# EAGLE design Rov3 - zsilanie cyfrowe (EAGLE 9.4.2)
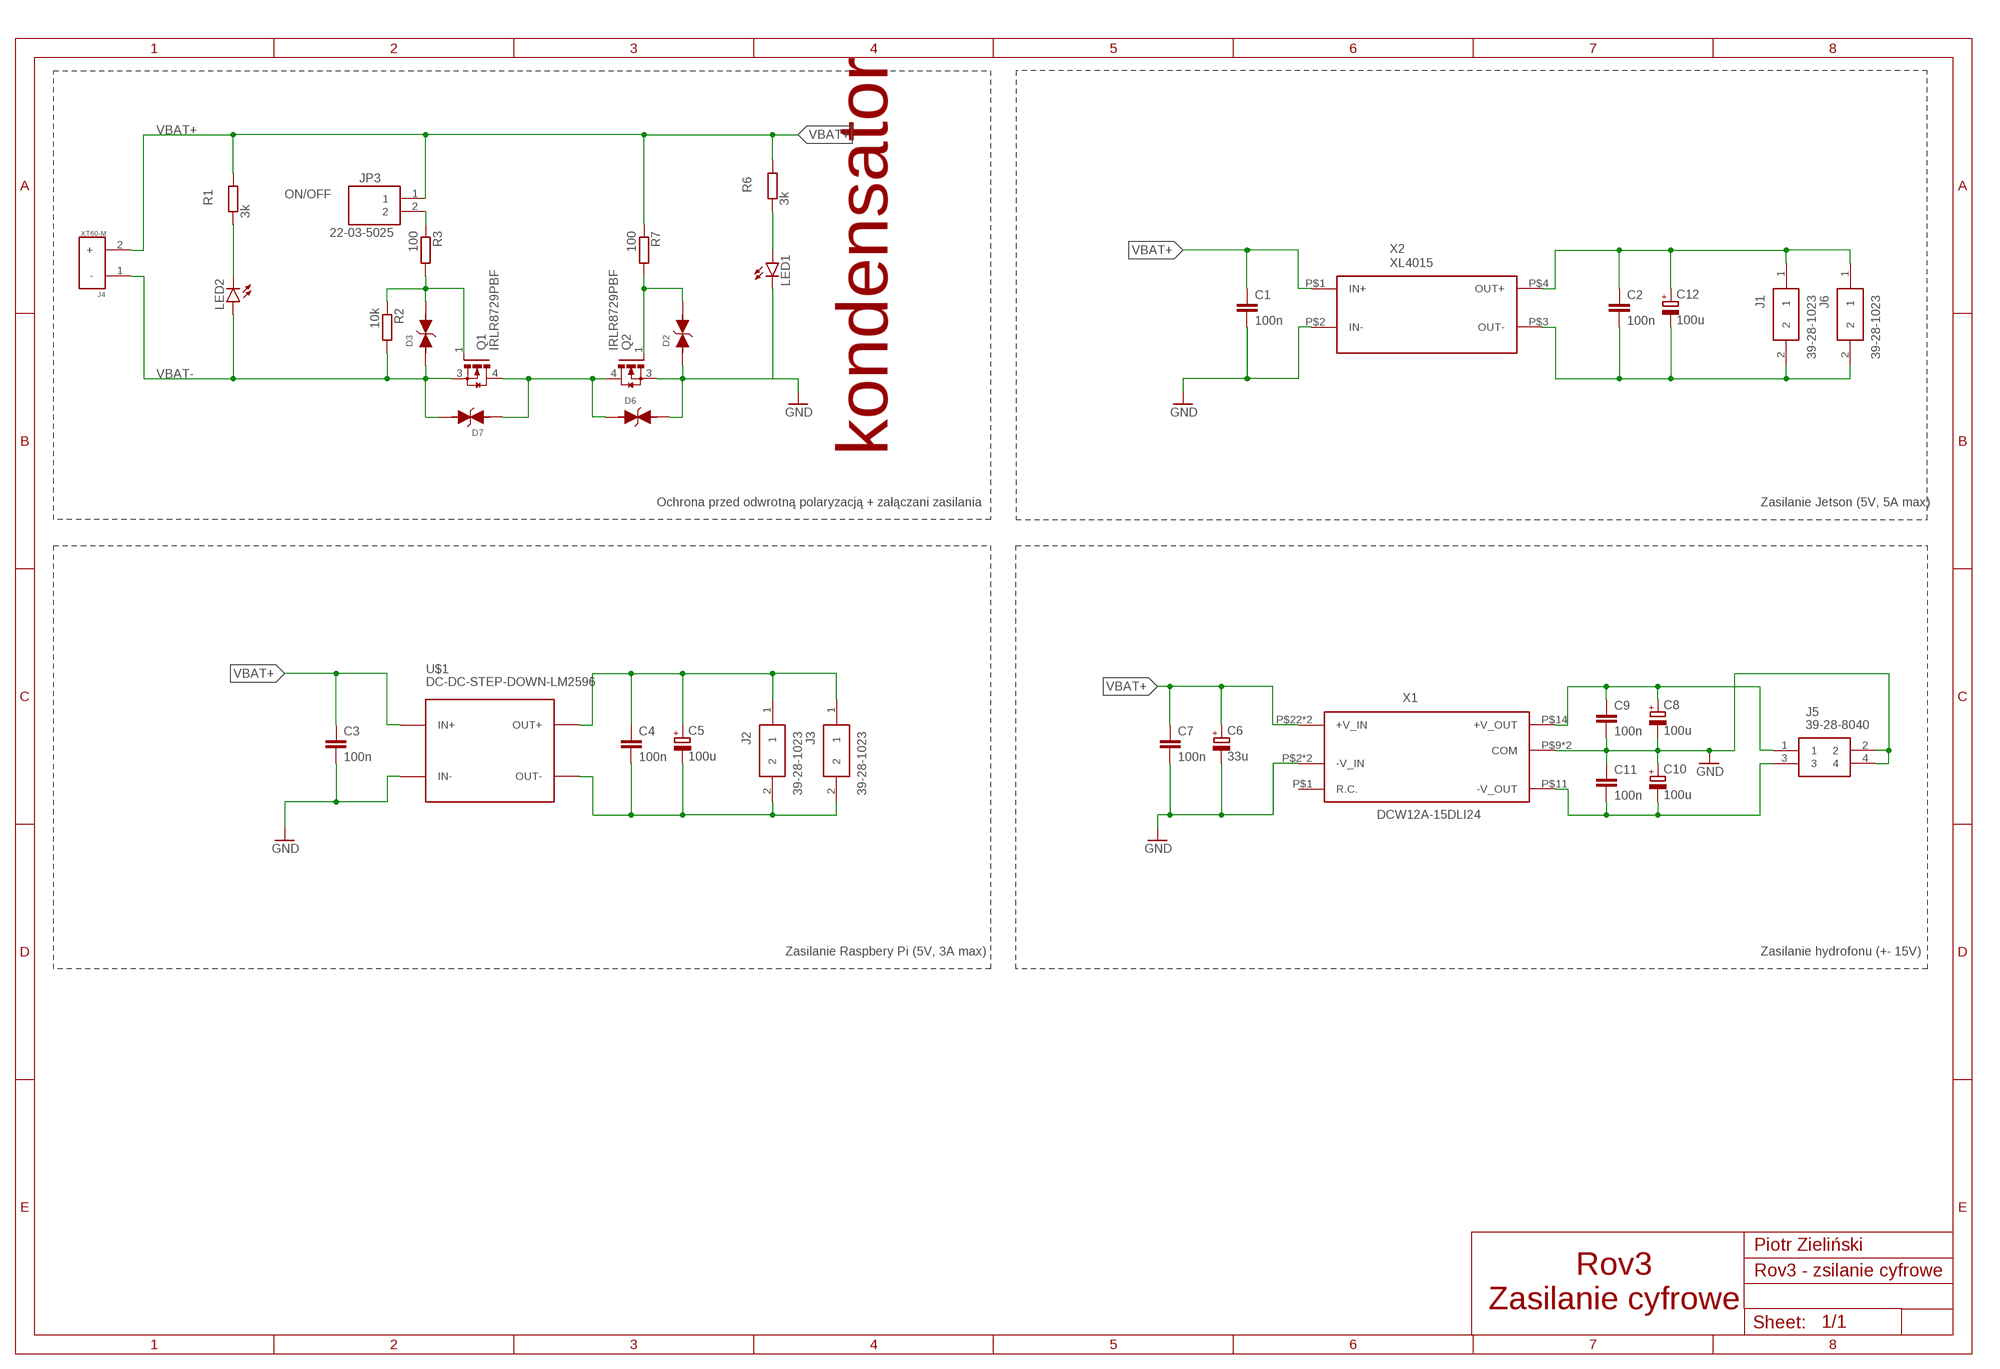
[diagram p0: schematic, sheet 1]

## Parts
C1  100n  C-EUC0805  [C0805]
C2  100n  C-EUC0805  [C0805]
C3  100n  C-EUC0805  [C0805]
C4  100n  C-EUC0805  [C0805]
C5  100u  CPOL-EUE3.5-8  [E3,5-8]
C6  33u  CPOL-EUE3.5-8  [E3,5-8]
C7  100n  C-EUC0805  [C0805]
C8  100u  CPOL-EUE3.5-8  [E3,5-8]
C9  100n  C-EUC0805  [C0805]
C10  100u  CPOL-EUE3.5-8  [E3,5-8]
C11  100n  C-EUC0805  [C0805]
C12  100u  CPOL-EUE3.5-8  [E3,5-8]
D2  P6SMB20A_824501101  [VARTVSP_SMA/DO-214AC]
D3  P6SMB20A_824501101  [VARTVSP_SMA/DO-214AC]
D6  P6SMB20A_824501101  [VARTVSP_SMA/DO-214AC]
D7  P6SMB20A_824501101  [VARTVSP_SMA/DO-214AC]
J1  39-28-1023  [MOLEX_1X2_PCB_SOCKET]
J2  39-28-1023  [MOLEX_1X2_PCB_SOCKET]
J3  39-28-1023  [MOLEX_1X2_PCB_SOCKET]
J4  XT60-M  [AMASS_XT60-M]
J5  39-28-8040  [MOLEX_2X2_PCB_SOCKET]
J6  39-28-1023  [MOLEX_1X2_PCB_SOCKET]
JP3  22-03-5025  [2.50MM_MINI-SPOX_2PIN_PCB_SOCKET]
LED1  LEDCHIP-LED0805  [CHIP-LED0805]
LED2  LEDCHIP-LED0805  [CHIP-LED0805]
Q1  IRLR8729PBF  [DPAK]
Q2  IRLR8729PBF  [DPAK]
R1  3k  R-EU_R1206  [R1206]
R2  10k  R-EU_R1206  [R1206]
R3  100  R-EU_R1206  [R1206]
R6  3k  R-EU_R1206  [R1206]
R7  100  R-EU_R1206  [R1206]
U$1  DC-DC-STEP-DOWN-LM2596  [DC-DC-STEP-DOWN-LM2596]
X1  DCW12A-15DLI24  [DCW12A-15]
X2  XL4015  [XL4015]

## Nets
2596+: C4.1 C5.+ J2.1 J3.1 U$1.OUT+
2596-: C4.2 C5.- J2.2 J3.2 U$1.OUT-
4015+: C2.1 C12.+ J1.1 J6.1 X2.P$4(OUT+)
4015-: C2.2 C12.- J1.2 J6.2 X2.P$3(OUT-)
DCW_+15: C8.+ C9.1 J5.1 X1.P$14(+V_OUT)
DCW_-15: C10.- C11.2 J5.3 X1.P$11(-V_OUT)
GND [supply]: C1.2 C3.2 C6.- C7.2 C8.- C9.2 C10.+ C11.1 D2.1 D6.2 J5.2 J5.4 LED1.C Q2.3(S) U$1.IN- X1.P$2(-V_IN) X1.P$3(-V_IN) X1.P$9(COM) X1.P$16(COM) X2.P$2(IN-)
N$1 [signal]: LED1.A R6.1
N$7 [signal]: JP3.2 R3.1
N$11: LED2.C R1.1
Q1_G [signal]: D3.2 Q1.1(G) R2.1 R3.2
Q1_Q2_D [supply]: D6.1 D7.1 Q1.4(D) Q2.4(D)
Q2G [signal]: D2.2 Q2.1(G) R7.2
VBAT+ [supply]: C1.1 C3.1 C6.+ C7.1 J4.2(+) JP3.1 R1.2 R6.2 R7.1 U$1.IN+ X1.P$22(+V_IN) X1.P$23(+V_IN) X2.P$1(IN+)
VBAT- [supply]: D3.1 D7.2 J4.1(-) LED2.A Q1.3(S) R2.2
Unconnected: X1.P$1(R.C.)

## Notes on the sheet
- ON/OFF
- kondensator
- Ochrona przed odwrotną polaryzacją + załączani zasilania | Zasilanie Jetson (5V, 5A max)
- Zasilanie Raspbery Pi (5V, 3A max) | Zasilanie hydrofonu (+- 15V)
- Piotr Zieliński
- Rov3
  Zasilanie cyfrowe

## Library data of the parts
C1-C4 C7 C9 C11 = rcl:C-EU: CAPACITOR, European symbol; SPICEPREFIX: C
C5 C6 C8 C10 C12 = rcl:CPOL-EU: POLARIZED CAPACITOR, European symbol; SPICEPREFIX: C
D2 D3 D6 D7 = SamacSys_Parts:P6SMB20A: WE-TVSP Power TVS Diode <http://katalog.we-online.de/media/images/v2/WE-TVSP_600W-3000W_D0214AA_4C.jpg> Details see: http://katalog.we-online.de/en/pbs/WE-TVSP/824500101 2015 (C) Würth Elektronik
J1-J3 J6 = SamacSys_Parts:39-28-1023: 2 way vertical PCB header,Mini-Fit Jr Molex MINI-FIT JR. Series, Series Number 5566, 4.2mm Pitch 2 Way 2 Row Straight PCB Header, Solder Termination, 9A Source: Datasheet <https://componentsearchengine.com/Datasheets/1/39-28-1023.pdf>; DESCRIPTION: 2 way vertical PCB header,Mini-Fit Jr Molex MINI-FIT JR. Series, Series Number 5566, 4.2mm Pitch 2 Way 2 Row Straight PCB Header, Solder Termination, 9A; HEIGHT: 13.1mm; MANUFACTURER_NAME: Molex; MANUFACTURER_PART_NUMBER: 39-28-1023; MOUSER_PART_NUMBER: 538-39-28-1023; MOUSER_PRICE-STOCK: https://www.mouser.com/Search/Refine.aspx?Keyword=538-39-28-1023
J4 = SamacSys_Parts:XT60-M: DC supply; XT60; male; PIN:2; for cable; soldered; 60A; 500V; AVAILABILITY: Unavailable; MF: AMASS; MP: XT60-M; PACKAGE: Package Analog Devices; PRICE: None
J5 = SamacSys_Parts:39-28-8040: Molex Mini-Fit Jr 5566, 4.2mm Pitch, 4 Way, 2 Row Male PCB Header Source: Datasheet <https://componentsearchengine.com/Datasheets/1/39-28-8040.pdf>; DESCRIPTION: Molex Mini-Fit Jr 5566, 4.2mm Pitch, 4 Way, 2 Row Male PCB Header; HEIGHT: 13.1mm; MANUFACTURER_NAME: Molex; MANUFACTURER_PART_NUMBER: 39-28-8040; MOUSER_PART_NUMBER: 538-39-28-8040; MOUSER_PRICE-STOCK: https://www.mouser.com/Search/Refine.aspx?Keyword=538-39-28-8040
JP3 = SamacSys_Parts:22-03-5025: Header 2.5mm SPOX,WTB,vert, shrouded, 2w Molex SPOX Series, Series Number 5267, 2.5mm Pitch 2 Way 1 Row Straight PCB Header, Solder Termination Source: Datasheet <https://componentsearchengine.com/Datasheets/1/22-03-5025.pdf>; DESCRIPTION: Header 2.5mm SPOX,WTB,vert, shrouded, 2w Molex SPOX Series, Series Number 5267, 2.5mm Pitch 2 Way 1 Row Straight PCB Header, Solder Termination; HEIGHT: 5.9mm; MANUFACTURER_NAME: Molex; MANUFACTURER_PART_NUMBER: 22-03-5025; MOUSER_PART_NUMBER: 538-22-03-5025; MOUSER_PRICE-STOCK: https://www.mouser.com/Search/Refine.aspx?Keyword=538-22-03-5025
LED1 LED2 = led:LED: LED OSRAM: - CHIPLED LG R971, LG N971, LY N971, LG Q971, LY Q971, LO R971, LY R971 LH N974, LH R974 LS Q976, LO Q976, LY Q976 LO Q996 - Hyper CHIPLED LW Q18S LB Q993, LB Q99A, LB R99A - SideLED LS A670, LO A670, LY A670, LG A670, LP A670 LB A673, LV A673, LT A673, LW A673 LH A674 LY A675 LS A676, LA A676, LO A676, LY A676, LW A676 LS A679, LY A679, LG A679 - Hyper Micro SIDELED® LS Y876, LA Y876, LO Y876, LY Y876 LT Y87S - SmartLED LW L88C, LW L88S LB L89C, LB L89S, LG L890 LS L89K, LO L89K, LY L89K LS L896, LA L896, LO L896, LY L896 - TOPLED LS T670, LO T670, LY T670, LG T670, LP T670 LSG T670, LSP T670, LSY T670, LOP T670, LYG T670 LG T671, LOG T671, LSG T671 LB T673, LV T673, LT T673, LW T673 LH T674 LS T676, LA T676, LO T676, LY T676, LB T676, LH T676, LSB T676, LW T676 LB T67C, LV T67C, LT T67C, LS T67K, LO T67K, LY T67K, LW E67C LS E67B, LA E67B, LO E67B, LY E67B, LB E67C, LV E67C, LT E67C LW T67C LS T679, LY T679, LG T679 LS T770, LO T770, LY T770, LG T770, LP T770 LB T773, LV T773, LT T773, LW T773 LH T774 LS E675, LA E675, LY E675, LS T675 LS T776, LA T776, LO T776, LY T776, LB T776 LHGB T686 LT T68C, LB T68C - Hyper Mini TOPLED® LB M676 - Mini TOPLED Santana® LG M470 LS M47K, LO M47K, LY M47K Source: http://www.osram.convergy.de LUXEON: - LUMILED® LXK2-PW12-R00, LXK2-PW12-S00, LXK2-PW14-U00, LXK2-PW14-V00 LXK2-PM12-R00, LXK2-PM12-S00, LXK2-PM14-U00 LXK2-PE12-Q00, LXK2-PE12-R00, LXK2-PE12-S00, LXK2-PE14-T00, LXK2-PE14-U00 LXK2-PB12-K00, LXK2-PB12-L00, LXK2-PB12-M00, LXK2-PB14-N00, LXK2-PB14-P00, LXK2-PB14-Q00 LXK2-PR12-L00, LXK2-PR12-M00, LXK2-PR14-Q00, LXK2-PR14-R00 LXK2-PD12-Q00, LXK2-PD12-R00, LXK2-PD12-S00 LXK2-PH12-R00, LXK2-PH12-S00 LXK2-PL12-P00, LXK2-PL12-Q00, LXK2-PL12-R00 Source: www.luxeon.com KINGBRIGHT: KA-3528ASYC Source: www.kingbright.com
Q1 Q2 = SamacSys_Parts:IRLR8729PBF
R1-R3 R6 R7 = rcl:R-EU_: RESISTOR, European symbol; SPICEPREFIX: R
U$1 = SamacSys_Parts:DC-DC-STEP-DOWN-LM2596: DC/DC Step-Down Regulator based on LM2596-ADJ chip LM2596 datasheet available here: http://www.ti.com/lit/ds/symlink/lm2596.pdf Click here to find device on ebay.com <http://www.ebay.com/sch/lm2596+power+regulator>
X1 = SamacSys_Parts:DCW12A-15
X2 = SamacSys_Parts:XL4015

## Net classes
0 default: width 0.4 mm, drill 0.9 mm, clearance 0.4 mm
1 signal: width 0.4 mm, drill 0.9 mm, clearance 0.4 mm
2 supply: width 1 mm, drill 0.9 mm, clearance 0.6 mm

## Board
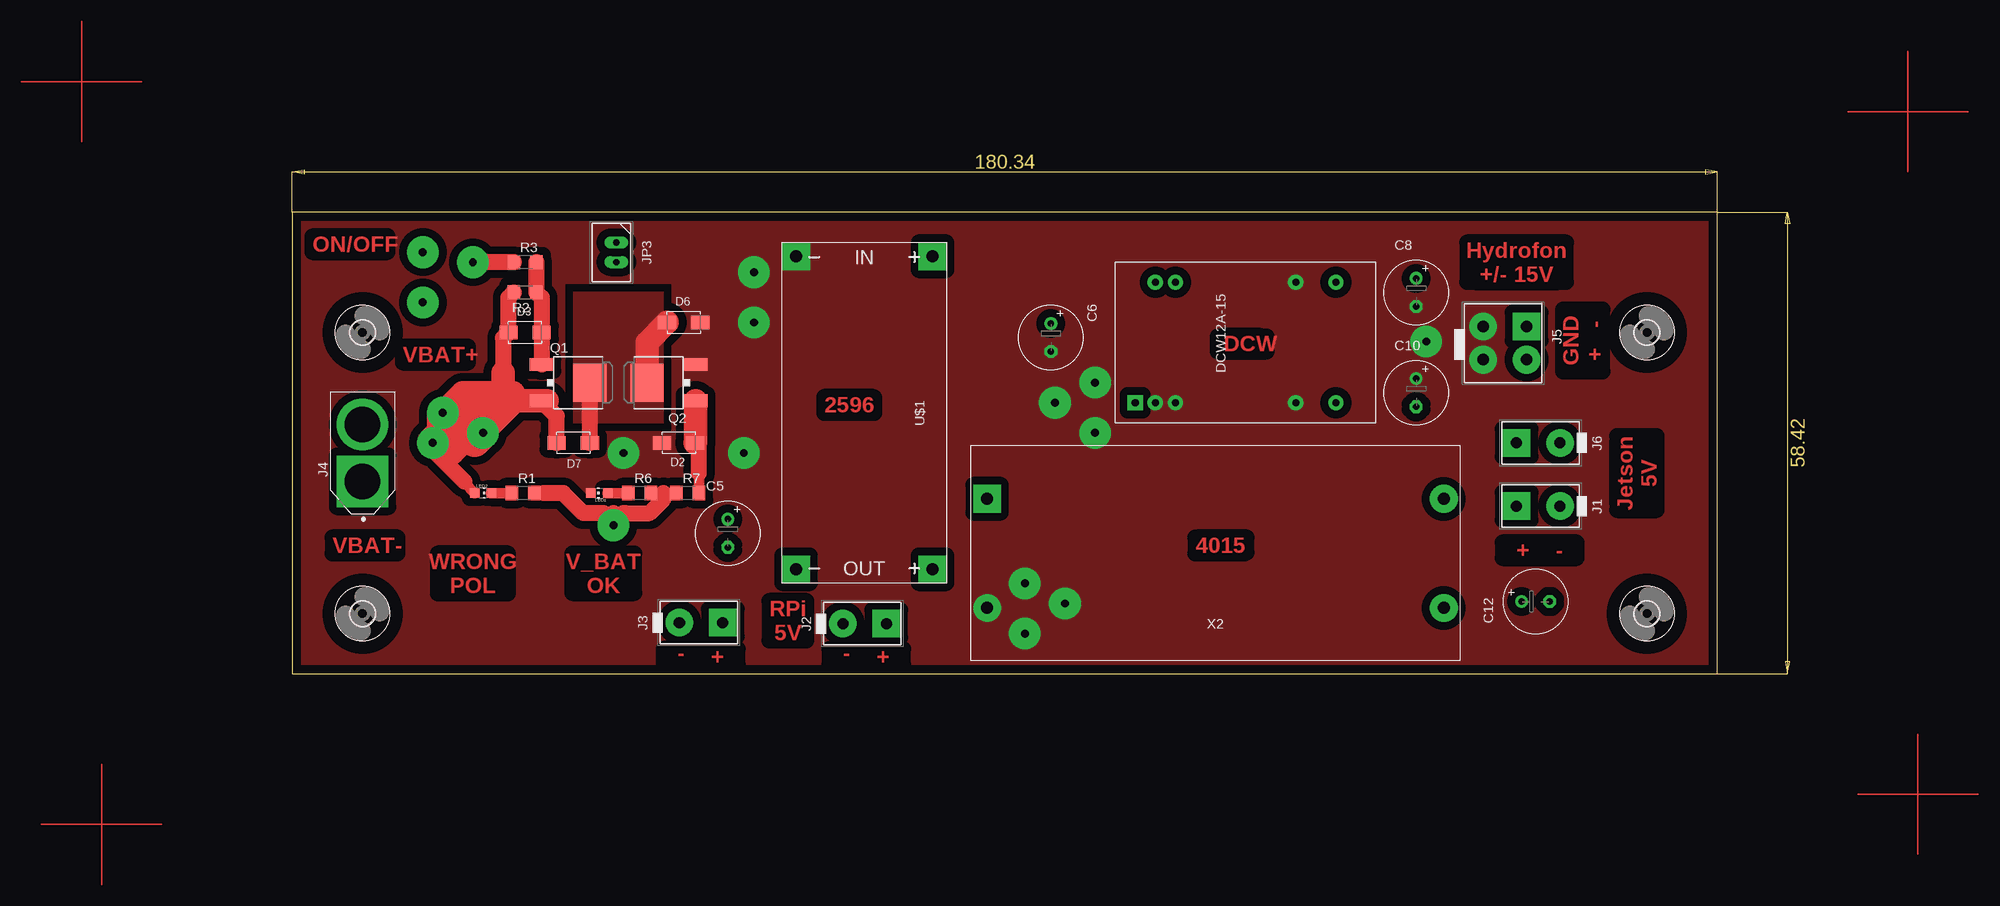
[diagram p1: board, top side]
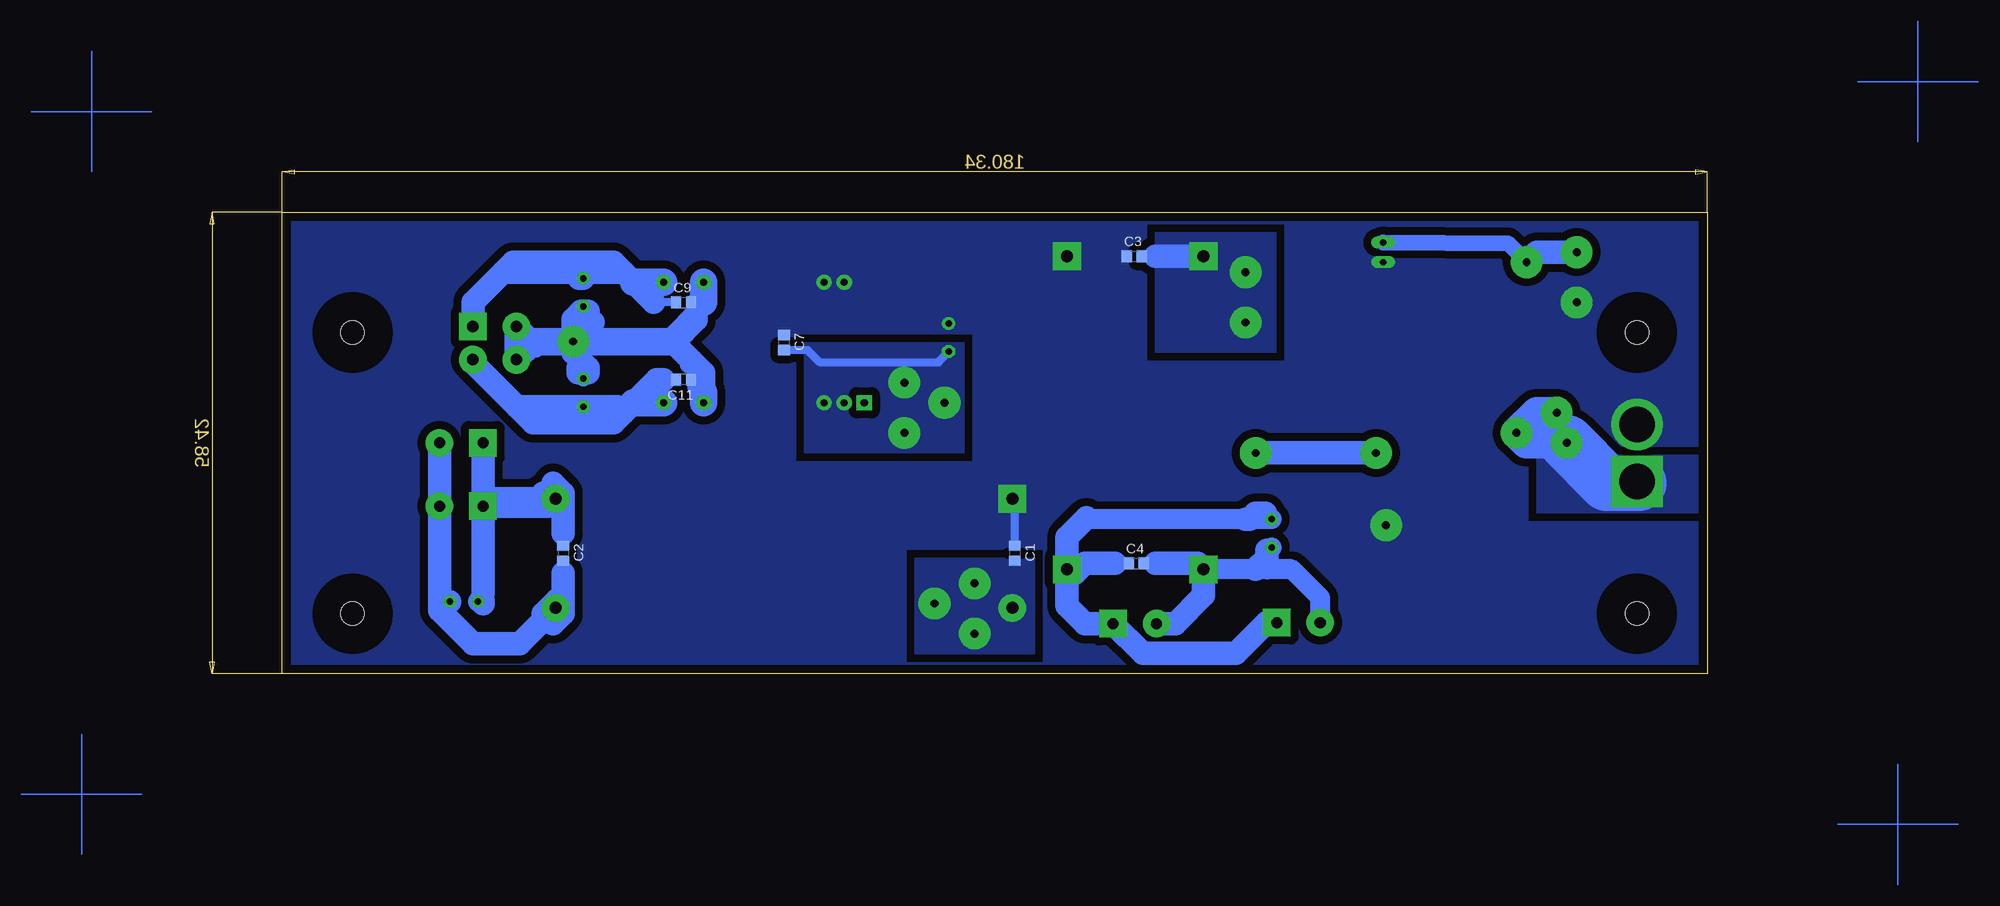
[diagram p2: board, bottom side, seen from below]

Size 189.53 x 63.8 mm. Coordinates in mm from the lower left corner, seen from the top.
Outline: 0,0 180.34,0 180.34,58.42 0,58.42 0,0
Copper layers (1*16): Top 0.035mm / dielectric 1.5mm / Bottom 0.035mm
Design rules "default *": minimum track width 0.5mm, minimum drill 0.9mm, track to track 0.4mm, track to pad 0.4mm, pad to pad 0.4mm, via to via 0.4mm, smd to smd 6mil, copper to edge 40mil, drill to drill 6mil, minimum pad ring 0.3mm, minimum via ring 0.3mm, stop-mask expansion 4mil, vias tented up to drill 0mil, thermal gap 12mil
tRestrict: area 5.1,15.2 to 13.3,17.3; area 14,39.4 to 22.2,41.4; area 18.4,10.2 to 27.3,15.2; area 35.4,10.3 to 43.2,15.1; area 167.6,21.6 to 172.5,29.3; area 149.9,49.5 to 160,54.6; area 3.8,53.3 to 12.1,55.4; area 67.4,33 to 73.7,34.9; area 114.6,15.4 to 120.8,17.3; area 117.1,40.8 to 123.3,42.7

### Footprints (pad centres in the part's own frame; a part is rotated, then mirrored left to right if it is on the bottom)
C0805 = smd 1.3 x 1.5: 1 -0.95,0; 2 0.95,0
E3,5-8 = drill 0.813 pad 1.6: + -1.778,0 | drill 0.813 pad 1.6 octagon: - 1.778,0
VARTVSP_SMA/DO-214AC = smd 2.3 x 1.7: 1 -2.1,0; 2 2.1,0
MOLEX_1X2_PCB_SOCKET = drill 1.4 pad 3.5 square: 1 0,2.54 | drill 1.4 pad 3.5: 2 0,-2.96
AMASS_XT60-M = drill 4.5 pad 5.588 square: 1 -3.6,0 | drill 4.5 pad 5.588: 2 3.6,0
MOLEX_2X2_PCB_SOCKET = drill 1.45 pad 3.5 square: 1 -2.54,2.54 | drill 1.45 pad 3.5: 2 -2.54,-2.96; 3 1.66,2.54; 4 1.66,-2.96
2.50MM_MINI-SPOX_2PIN_PCB_SOCKET = drill 0.8 pad 1.524 long: 1 1.27,0; 2 -1.23,0
CHIP-LED0805 = smd 1.2 x 1.2: A 0,-1.05; C 0,1.05
DPAK = smd 1.6 x 3: 1 -2.28,-4.04; 3 2.28,-4.04 | smd 4.826 x 4.191: 4 0,2.096
R1206 = smd 1.6 x 1.803: 1 -1.422,0; 2 1.422,0
DC-DC-STEP-DOWN-LM2596 = drill 1.5 pad 3.5 square: IN+ -19.812,8.636; IN- -19.812,-8.636; OUT+ 19.812,8.636; OUT- 19.812,-8.636
3,0 = hole 3: 0,0
DCW12A-15 = drill 0.9 pad 1.93 square: P$1 -7.62,13.97 | drill 0.9 pad 1.93: P$2 -7.62,11.43; P$3 -7.62,8.89; P$9 -7.62,-6.35; P$11 -7.62,-11.43; P$14 7.62,-11.43; P$16 7.62,-6.35; P$22 7.62,8.89; P$23 7.62,11.43
XL4015 = drill 1.5 pad 3.5 square: P$1 -28.9,6.9 | drill 1.5 pad 3.5: P$2 -28.9,-6.9; P$3 28.9,-6.9; P$4 28.9,6.9

### Placement (x,y rotation side)
C1  87.63,15.24 270 bottom
C2  144.78,15.24 270 bottom
C3  72.52,52.83 0 bottom
C4  72.26,13.97 0 bottom
C5  55.12,17.78 270 top
C6  96.01,42.55 270 top
C7  116.84,41.91 270 bottom
C8  142.24,48.26 270 top
C9  129.54,46.99 0 bottom
C10  142.24,35.56 270 top
C11  129.54,37.21 180 bottom
C12  157.35,9.14 0 top
D2  48.9,29.21 0 top
D3  29.46,43.18 0 top
D6  49.53,44.45 0 top
D7  35.56,29.21 180 top
J1  157.48,21.21 90 top
J2  72.64,6.35 270 top
J3  51.94,6.48 270 top
J4  8.89,27.94 90 top
J5  153.67,41.4 270 top
J6  157.48,29.21 90 top
JP3  41.02,53.34 270 top
LED1  38.86,22.86 90 top
LED2  24.13,22.86 270 top
Q1  35.56,36.83 270 top
Q2  46.99,36.83 90 top
R1  29.21,22.86 0 top
R2  29.46,48.26 180 top
R3  29.46,52.07 0 top
R6  43.94,22.86 0 top
R7  50.04,22.86 0 top
U$1  72.39,33.02 270 top
U$2  [3,0]  8.89,7.62 0 top
U$3  [3,0]  8.89,43.18 0 top
U$4  [3,0]  171.45,43.18 0 top
U$5  [3,0]  171.45,7.62 0 top
X1  120.65,41.91 90 top
X2  116.84,15.24 0 top

### Tracks (layer width: path | path; a pad name or v marks a point on that pad's centre or on a via)
2596+
  Bottom 1.3: C4.1 74.93,13.97
  Bottom 2: J2.1 71.37,2.54 59.69,2.54 55.75,6.48
  Bottom 2.5: C5.+ 58.42,19.56 78.34,19.56 78.54,19.76
  Bottom 3: U$1.OUT+ 81.03,8.64 78.74,6.35 J2.1 71.43,2.59 59.64,2.59 55.75,6.48 J3.1 | 78.54,19.76 81.03,17.27 U$1.OUT+ | 74.93,13.97 78.74,13.97 80.01,12.7 80.52,12.7 U$1.OUT+ | 58.42,19.56 57.91,19.56 57.15,20.32 55.88,20.32
2596-
  Bottom 1.3: 69.85,13.97 C4.2
  Bottom 2.5: C5.- 55.71,15.66 55.71,14.64 55.71,13.21 | 55.71,13.21 57.15,13.21 U$1.OUT- | J3.2 48.98,9.61 52.58,13.21 55.71,13.21
  Bottom 3: J2.2 67.31,6.35 63.75,9.91 U$1.OUT- 64.52,13.97 69.85,13.97 | 57.15,13.21 55.71,14.64 55.71,15.66
4015+
  Bottom 1.2: C2.1 144.78,17.78
  Bottom 2: 154.94,10.16 154.94,9.27
  Bottom 2.5: C12.+ 154.94,9.27
  Bottom 3: X2.P$4 154.01,22.14 J1.1 | J1.1 J6.1 | 154.94,10.16 J1.1 | 144.78,21.18 144.78,20.32 144.78,17.78 | X2.P$4 144.78,21.18 | J1.1 146.67,21.21 X2.P$4 | X2.P$4 146.46,22.86 147.32,22.86 | 154.94,9.27 154.94,8.89 | 144.78,21.18 144.78,22.86 146.05,24.13
4015-
  Bottom 1.2: C2.2 144.78,12.7
  Bottom 2.5: 159.84,8.64 160.44,8.04
  Bottom 3: J6.2 J1.2 160.44,8.04 156.21,3.81 150.27,3.81 X2.P$3 144.78,9.3 | 144.78,12.7 144.78,9.3 | 144.78,9.3 145.64,9.3 147.32,7.62 | 144.78,9.3 144.78,7.62 146.05,6.35 | C12.- 159.84,8.64
DCW_+15
  Bottom 1: C9.1 133.35,46.99
  Bottom 2: 156.21,44.45 J5.1
  Bottom 3: 133.35,46.99 135.89,49.53 137.16,50.8 | J5.1 156.21,46.99 152.4,50.8 | 137.16,50.8 138.43,52.07 140.97,52.07 | 140.97,52.07 142.24,52.07 | 142.24,52.07 144.78,52.07 | 144.78,52.07 151.13,52.07 152.4,50.8 | C8.+ 142.24,52.07 | C8.+ 140.97,51.31 140.97,52.07 | C8.+ 142.75,50.04 144.78,52.07 | 152.4,50.8 137.16,50.8
  Bottom 3.5: X1.P$14 135.89,49.53
DCW_-15
  Bottom 1: C11.2 132.08,37.21
  Bottom 2: 156.21,39.37 J5.3
  Bottom 3: 150.62,33.78 C10.- 137.92,33.78 137.16,33.02 | 156.21,39.37 148.59,31.75 138.43,31.75 137.16,33.02 | 137.16,33.02 135.89,34.29 132.97,37.21 132.08,37.21
  Bottom 3.5: X1.P$11 135.89,34.29
GND  (via drill 1 pad 4)
  Bottom 1: 69.85,52.83 C3.2 | C6.- 97.28,39.5 97.28,39.37 112.27,39.37 113.86,40.96 C7.2 | 127.61,36.23 C11.1 128.59,39.37 | 128.27,46.99 C9.2 128.27,46.67 128.27,45.72 | 144.83,41.91 144.78,41.91 144.91,42.04 | 130.81,41.91 130.81,43.18 | C8.- 142.75,45.97 142.75,45.59
  Bottom 2: X1.P$16 127,48.26 128.27,46.99 | 144.91,42.04 v143.51,42.04 132.08,42.04 131.95,42.04 130.81,43.18 128.27,45.72 | 142.24,44.5 144.83,41.91 147.32,41.91 148.17,41.06 148.17,41.49 | C10.+ 142.24,39.37 144.78,41.91 | 128.59,39.69 130.81,41.91
  Bottom 3: v41.91,27.94 v57.15,27.94 | U$1.IN- 69.85,52.83 | 148.68,41.91 147.32,41.91 143.51,41.91 | 143.51,41.91 139.7,41.91 | 139.7,41.91 130.81,41.91 | 148.68,41.91 J5.2 J5.4 148.68,41.77 148.68,41.91 | 131.95,42.04 130.94,42.04 128.59,39.69 | 132.08,42.04 130.68,42.04 127.94,44.78 127.94,45.72 | 127.61,36.23 127,35.62 127,38.1 128.59,39.69 | 128.59,39.69 128.59,39.4 128.58,39.38 | v143.51,42.04 143.51,44.83 142.75,45.59 | v143.51,42.04 143.51,41.91 | 140.97,44.45 142.11,45.59 142.75,45.59 | 142.75,45.59 142.49,45.85 141.6,45.85 | 143.51,41.91 143.51,40.64 142.24,39.37 | 142.24,39.37 142.88,38.73 142.88,38.1 | 142.24,39.37 141.6,38.73 141.6,38.1 | 139.7,41.91 139.83,42.04 v143.51,42.04
  Bottom 3.5: X1.P$16 127,46.99 | 130.94,42.04 v143.51,42.04 148.41,42.04 148.68,41.77 | X1.P$9 127,35.62
  other vias: 92.71,11.43 97.79,8.89 92.71,5.08 101.6,30.48 101.6,36.83 96.52,34.29 58.42,50.8 58.42,44.45
  pour Top (isolate 1, rank 3, no thermals): 0,0 180.34,0 180.34,58.42 0,58.42
  pour Bottom (isolate 1, no thermals): 54.61,55.88 54.61,40.64 69.85,40.64 69.85,55.88
  pour Bottom (isolate 1, no thermals): 93.98,41.91 114.3,41.91 114.3,27.94 93.98,27.94
  pour Bottom (isolate 1, no thermals): 85.09,14.61 100.33,14.61 100.33,2.54 85.09,2.54
N$1
  Top 1.3: LED1.A R6.1
N$2
  Top 0.2: -26.67,82.55 -26.67,67.31
N$3
  Top 0.2: -34.29,74.93 -19.05,74.93
N$4
  Bottom 0.2: -26.67,82.55 -26.67,67.31
N$5
  Bottom 0.2: -34.29,74.93 -19.05,74.93
N$6
  Top 0.2: 204.47,78.74 204.47,63.5
N$7  (via drill 1 pad 4)
  Top 2: R3.1 v22.86,52.07
  Bottom 2: JP3.2 25.24,54.45 v22.86,52.07
  Bottom 3: v22.86,52.07 21.59,53.34 v16.51,53.34
N$8
  Top 0.2: 196.85,71.12 212.09,71.12
N$9
  Bottom 0.2: 204.47,78.74 204.47,63.5
N$10
  Bottom 0.2: 196.85,71.12 212.09,71.12
N$11
  Top 1.3: LED2.C R1.1
N$12
  Top 0.2: 205.74,-7.62 205.74,-22.86
N$13
  Top 0.2: 198.12,-15.24 213.36,-15.24
N$14
  Bottom 0.2: 205.74,-7.62 205.74,-22.86
N$15
  Bottom 0.2: 198.12,-15.24 213.36,-15.24
N$16
  Top 0.2: -24.13,-11.43 -24.13,-26.67
N$17
  Top 0.2: -31.75,-19.05 -16.51,-19.05
N$18
  Bottom 0.2: -24.13,-11.43 -24.13,-26.67
N$19
  Bottom 0.2: -31.75,-19.05 -16.51,-19.05
Q1_G
  Top 1: 31.56,39.15 Q1.1
  Top 2: R3.2 R2.1 31.56,47.58 D3.2 31.56,39.15
Q1_Q2_D
  Top 2: Q1.4 D7.1
  Top 3: Q2.4 44.89,41.91 D6.1
  pour Top (no thermals): 35.56,31.75 46.99,31.75 46.99,48.26 35.56,48.26
Q2G
  Top 1.3: R7.2 51.46,25.4
  Top 2: D2.2 51.46,28.75 51.46,25.4
  Top 3: Q2.1 51.03,29.25 D2.2
VBAT+  (via drill 1 pad 4)
  Top 1: R6.2 46.99,22.86 R7.1 47.76,22.86 45.22,20.32 | 31.75,22.86 R1.2 | 39.37,20.32 40.64,20.32 41.91,20.32
  Top 2: v40.64,18.8 42.16,20.32 | 41.91,20.32 42.16,20.32 | 42.16,20.32 45.22,20.32 46.99,22.09 46.99,22.86 | v40.64,18.8 40.64,20.32 | v40.64,18.8 39.12,20.32 | 39.37,20.32 39.12,20.32 | 39.12,20.32 36.83,20.32 34.29,22.86 31.75,22.86
  Bottom 1: C1.1 87.63,21.83 X2.P$1
  other vias: 16.51,46.99
  pour Bottom (isolate 1, rank 3, no thermals): 0,0 180.34,0 180.34,58.42 0,58.42
VBAT-  (via drill 1 pad 4)
  Top 1.3: LED2.A 21.79,24.15 21.79,24.33
  Top 2: 26.67,38.1 26.67,42.49 D3.1 27.36,47.58 R2.2 | D7.2 33.46,32.61 Q1.3 | 21.79,24.33 17.78,28.33 v17.78,29.21
  Top 3: 24.13,33.02 v19.05,33.02 21.59,35.56 27.94,35.56 | 20.32,27.94 22.86,30.48 v24.13,30.48 28.2,34.55 | 28.2,34.55 Q1.3 32.25,34.55 32.26,34.54 | 26.67,38.1 26.67,34.29 26.93,34.55 28.2,34.55
  Top 4: v24.13,30.48 23.07,29.42 | v24.13,30.48 23.1,31.51 21.43,31.51 | 21.43,31.51 19.13,29.21 v17.78,29.21 19.05,30.48 v19.05,33.02 | v19.05,33.02 20.56,31.51 21.43,31.51 | v24.13,30.48 21.59,33.02 v19.05,33.02
  Bottom 4: J4.1 8.68,24.13 | v19.05,33.02 19.05,30.48 v17.78,29.21 22.86,29.21 v24.13,30.48 21.59,33.02 v19.05,33.02
  Bottom 7: v17.78,29.21 12.7,24.13 8.68,24.13
  pour Bottom (isolate 1, no thermals): 21.59,27.69 0,27.69 0,20.32 21.59,20.32

### Text on the board
Top: ON/OFF | Hydrofon / +/- 15V | GND / + - | DCW | VBAT+ | 2596 | Jetson / 5V | + - | VBAT- | 4015 | WRONG / POL | V_BAT / OK | RPi / 5V | + - | + -